# Altium schematic sheet PWM控制LED.SchDoc
size A4
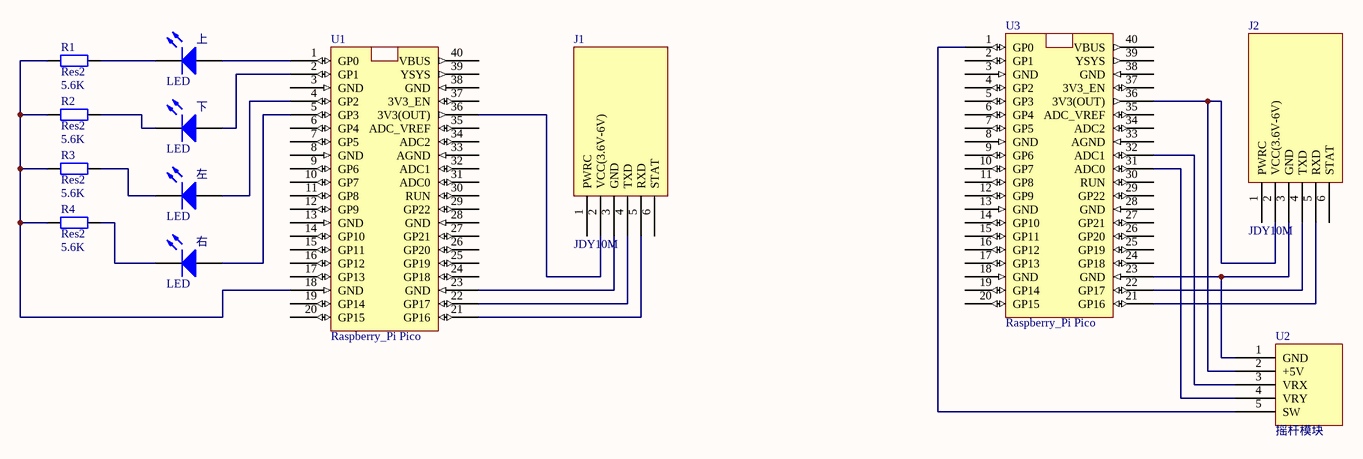
[diagram p0: PWM控制LED.SchDoc]

## Parts
J1  JDY10M
J2  JDY10M
R1  Res2  value 5.6K  [AXIAL-0.4]
R2  Res2  value 5.6K  [AXIAL-0.4]
R3  Res2  value 5.6K  [AXIAL-0.4]
R4  Res2  value 5.6K  [AXIAL-0.4]
U1  Raspberry_Pi Pico
U2  摇杆模块
U3  Raspberry_Pi Pico
上  LED  [LED-0]
下  LED  [LED-0]
右  LED  [LED-0]
左  LED  [LED-0]

## Nets
NetJ1_2: J1.2(VCC(3.6V-6V)) U1.36(3V3(OUT))
NetJ1_3: J1.3(GND) U1.23(GND)
NetJ1_4: J1.4(TXD) U1.22(GP17)
NetJ1_5: J1.5(RXD) U1.21(GP16)
NetJ2_2: J2.2(VCC(3.6V-6V)) U2.2(+5V) U3.36(3V3(OUT))
NetJ2_3: J2.3(GND) U2.1(GND) U3.23(GND)
NetJ2_4: J2.4(TXD) U3.22(GP17)
NetJ2_5: J2.5(RXD) U3.21(GP16)
NetR1_1: R1.1 R2.1 R3.1 R4.1 U1.18(GND)
NetR1_2: R1.2 上.2(K)
NetR2_2: R2.2 下.2(K)
NetR3_2: R3.2 左.2(K)
NetR4_2: R4.2 右.2(K)
NetU1_1: U1.1(GP0) 上.1(A)
NetU1_2: U1.2(GP1) 下.1(A)
NetU1_4: U1.4(GP2) 左.1(A)
NetU1_5: U1.5(GP3) 右.1(A)
NetU2_3: U2.3(VRX) U3.32(ADC1)
NetU2_4: U2.4(VRY) U3.31(ADC0)
NetU2_5: U2.5(SW) U3.1(GP0)

Not connected (* = marked no-connect by the designer): J1 1(PWRC) 6(STAT); J2 1(PWRC) 6(STAT); U1 3(GND) 6(GP4) 7(GP5) 8(GND) 9(GP6) 10(GP7) 11(GP8) 12(GP9) 13(GND) 14(GP10) 15(GP11) 16(GP12) 17(GP13) 19(GP14) 20(GP15) 24(GP18) 25(GP19) 26(GP20) 27(GP21) 28(GND) 29(GP22) 30(RUN) 31(ADC0) 32(ADC1) 33(AGND) 34(ADC2) 35(ADC_VREF) 37(3V3_EN) 38(GND) 39(YSYS) 40(VBUS); U3 2(GP1) 3(GND) 4(GP2) 5(GP3) 6(GP4) 7(GP5) 8(GND) 9(GP6) 10(GP7) 11(GP8) 12(GP9) 13(GND) 14(GP10) 15(GP11) 16(GP12) 17(GP13) 18(GND) 19(GP14) 20(GP15) 24(GP18) 25(GP19) 26(GP20) 27(GP21) 28(GND) 29(GP22) 30(RUN) 33(AGND) 34(ADC2) 35(ADC_VREF) 37(3V3_EN) 38(GND) 39(YSYS) 40(VBUS)

## Library data of the parts
R1-R4 = Res2: Resistor; Published: 8-Jun-2000; LatestRevisionDate: 17-Jul-2002; LatestRevisionNote: Re-released for DXP Platform.; PackageReference: AXIAL-0.4; Publisher: Altium Limited; PackageDescription: Axial Device, Thru-Hole; 2 Leads; 0.4 in Pin Spacing
上 下 右 左 = LED0: Typical INFRARED GaAs LED; Published: 8-Jun-2000; LatestRevisionDate: 08-Jul-2005; LatestRevisionNote: Mech Layer 1 removed.; PackageReference: LED-0; Publisher: Altium Limited; PackageDescription: LED; 2 Leads